# Altium schematic sheet BW1098OBC_Project_Information.SchDoc: =project_title
size Tabloid; CompanyName: Luxonis Holding; Organization: Luxonis Holding; Address1: 1925 Harmony Park Drive; Address2: Westminster, CO; Address3: 80234; Address4: United States; SheetNumber: 1; SheetTotal: 8
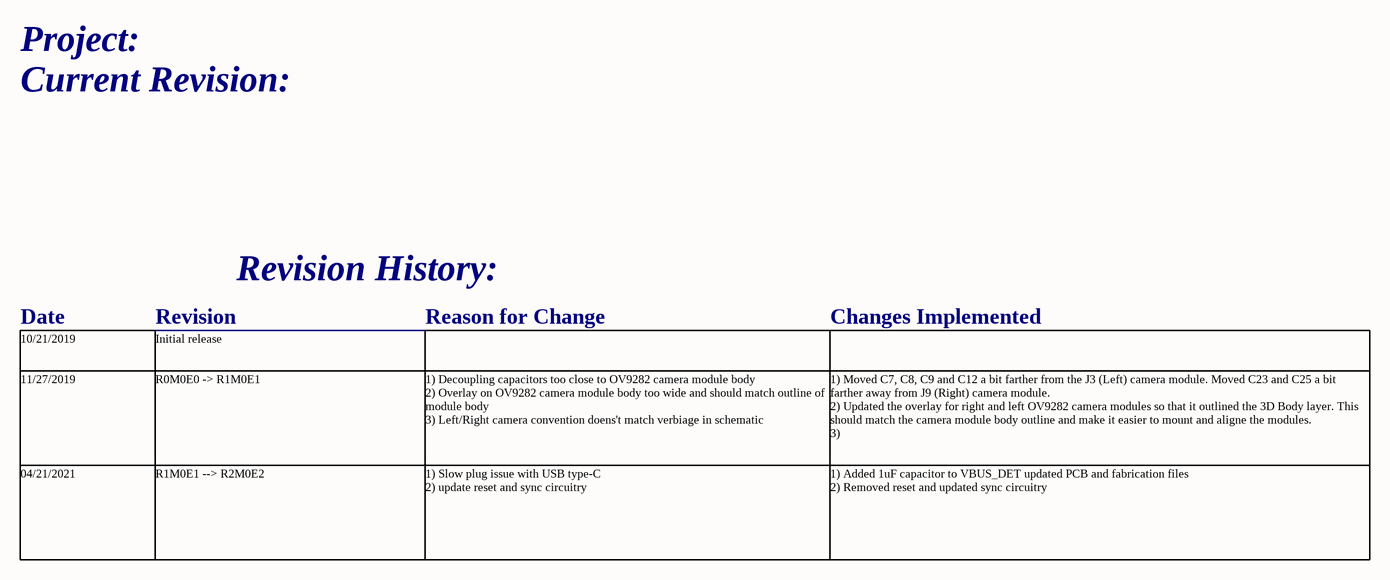
[diagram p0: BW1098OBC_Project_Information.SchDoc]

## Notes on the sheet
- Project:
- Current Revision:
- Revision History:
- 10/21/2019
- Date
- Initial release
- Revision
- Reason for Change
- Changes Implemented
- 11/27/2019
- R0M0E0 -> R1M0E1
- 1) Decoupling capacitors too close to OV9282 camera module body
  2) Overlay on OV9282 camera module body too wide and should match outline of module body
  3) Left/Right camera convention doens't match verbiage in schematic
- 1) Moved C7, C8, C9 and C12 a bit farther from the J3 (Left) camera module. Moved C23 and C25 a bit farther away from J9 (Right) camera module.
  2) Updated the overlay for right and left OV9282 camera modules so that it outlined the 3D Body layer. This should match the camera module body outline and make it easier to mount and aligne the modules.
  3)
- 04/21/2021
- R1M0E1 --> R2M0E2
- 1) Slow plug issue with USB type-C
  2) update reset and sync circuitry
- 1) Added 1uF capacitor to VBUS_DET updated PCB and fabrication files
  2) Removed reset and updated sync circuitry
- Title
- Size:
- Date:
- Tabloid
- Number:
- Time:
- Revision:
- Sheet
- of
- Drawn by: